# EAGLE schematic board_with_sense (EAGLE 6.1)

## Sheet 1 of 2
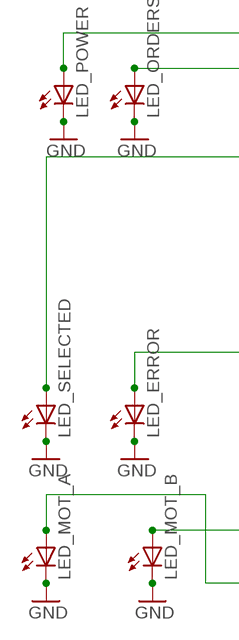
[diagram p0: schematic, sheet 1, part 1 of 2]
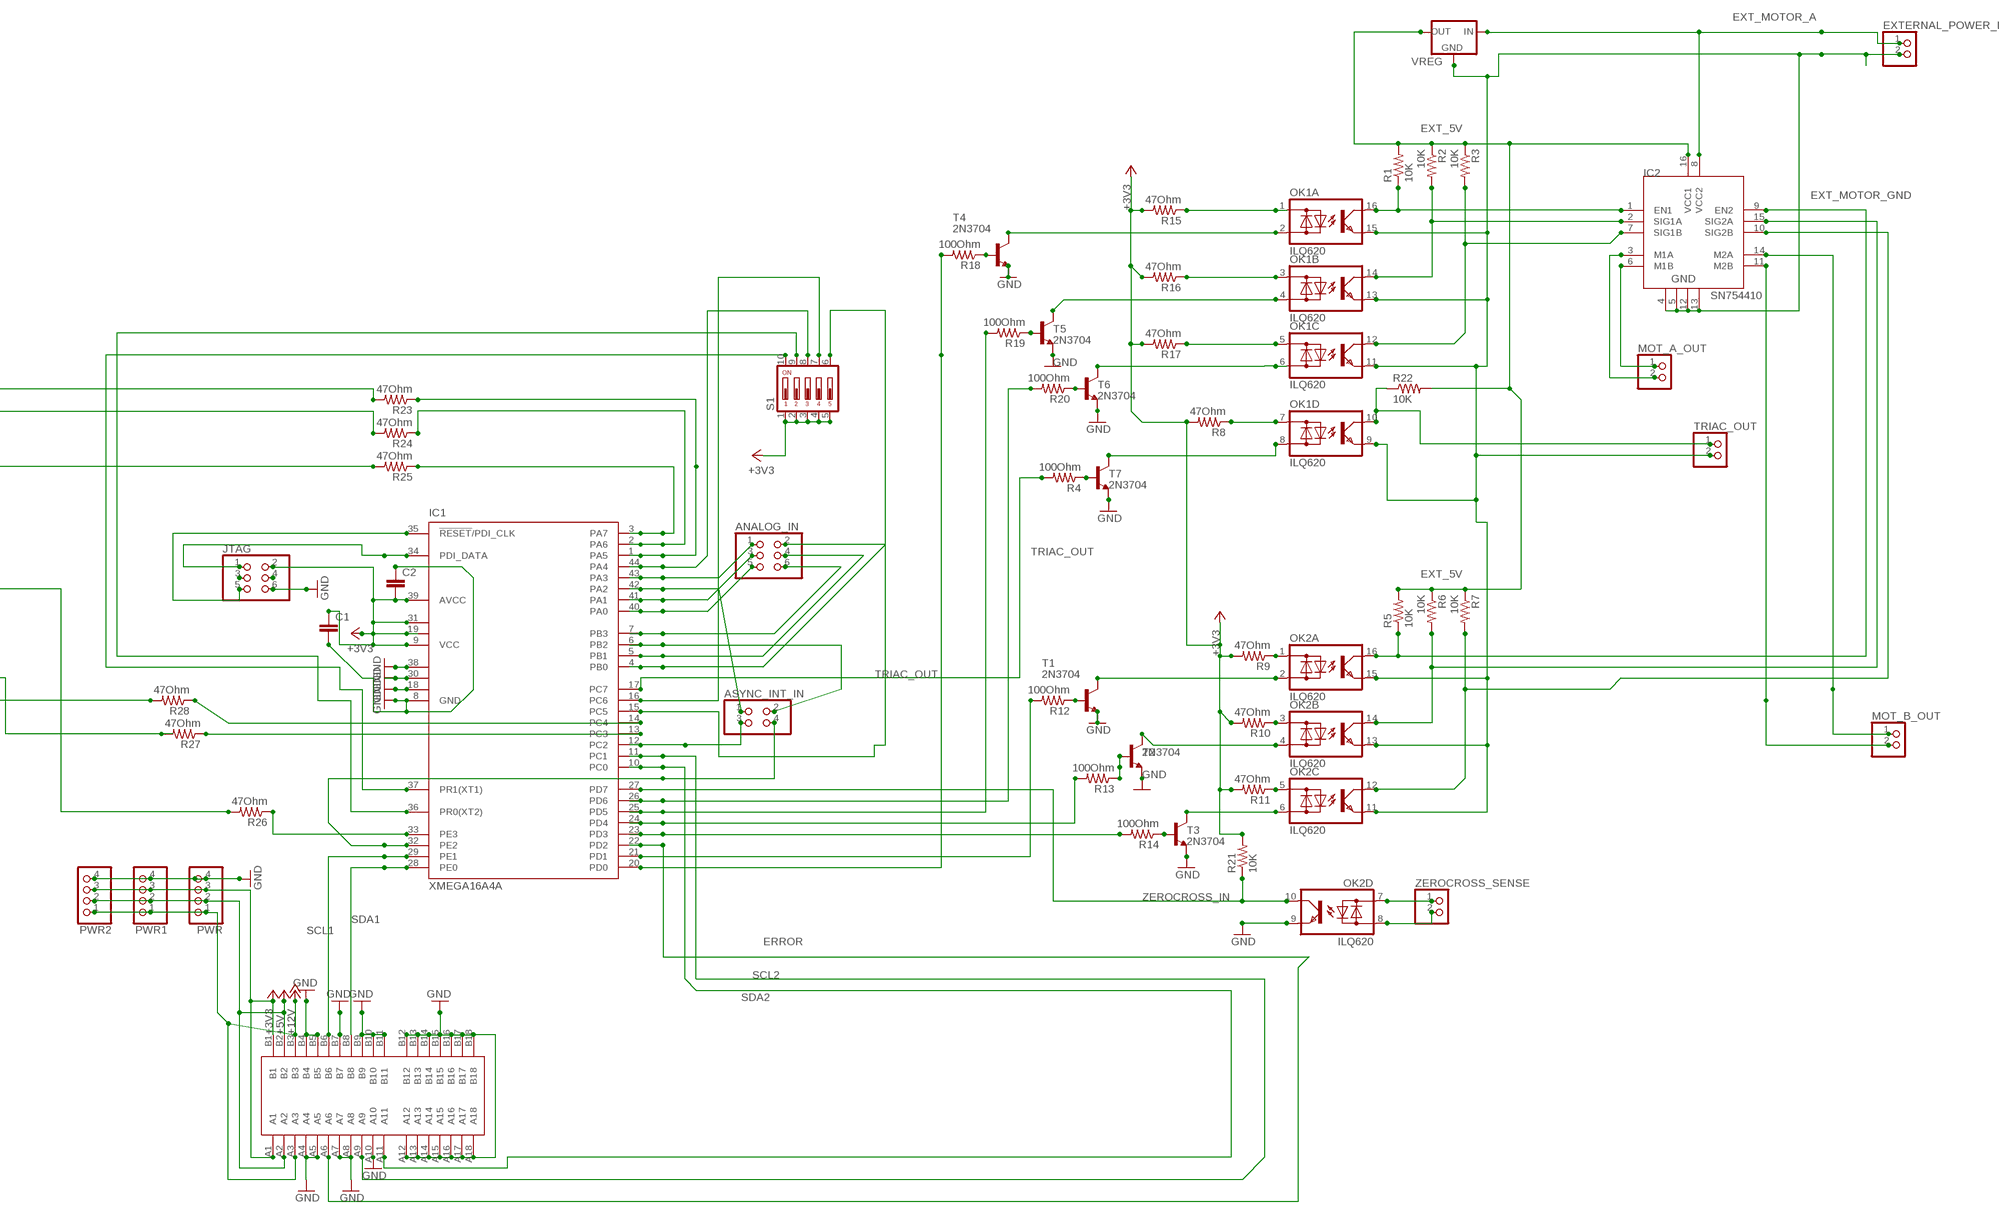
[diagram p1: schematic, sheet 1, part 2 of 2]

### Parts
ANALOG_IN  PINHD-2X3  [2X03]
ASYNC_INT_IN  PINHD-2X2  [2X02]
C1  C2.5/4  [C2.5-4]
C2  C2.5/4  [C2.5-4]
EXTERNAL_POWER_IN  PINHD-1X2  [1X02]
IC1  XMEGA16A4A  [TQFP44]
IC2  SN754410  [DIP16]
JTAG  PINHD-2X3  [2X03]
LED_ERROR  LED5MM  [LED5MM]
LED_MOT_A  LED5MM  [LED5MM]
LED_MOT_B  LED5MM  [LED5MM]
LED_ORDERS  LED5MM  [LED5MM]
LED_POWER  LED5MM  [LED5MM]
LED_SELECTED  LED5MM  [LED5MM]
MOT_A_OUT  PINHD-1X2  [1X02]
MOT_B_OUT  PINHD-1X2  [1X02]
OK1  ILQ620  [DIL16]
OK2  ILQ620  [DIL16]
PWR  PINHD-1X4  [1X04]
PWR1  PINHD-1X4  [1X04]
PWR2  PINHD-1X4  [1X04]
R1  10K  R-US_R0805  [R0805]
R2  10K  R-US_R0805  [R0805]
R3  10K  R-US_R0805  [R0805]
R4  100Ohm  R-US_0207/10  [0207/10]
R5  10K  R-US_R0805  [R0805]
R6  10K  R-US_R0805  [R0805]
R7  10K  R-US_R0805  [R0805]
R8  47Ohm  R-US_0207/10  [0207/10]
R9  47Ohm  R-US_0207/10  [0207/10]
R10  47Ohm  R-US_0207/10  [0207/10]
R11  47Ohm  R-US_0207/10  [0207/10]
R12  100Ohm  R-US_0207/10  [0207/10]
R13  100Ohm  R-US_R0805  [R0805]
R14  100Ohm  R-US_R0805  [R0805]
R15  47Ohm  R-US_0207/10  [0207/10]
R16  47Ohm  R-US_0207/10  [0207/10]
R17  47Ohm  R-US_0207/10  [0207/10]
R18  100Ohm  R-US_R0805  [R0805]
R19  100Ohm  R-US_R0805  [R0805]
R20  100Ohm  R-US_R0805  [R0805]
R21  10K  R-US_0207/10  [0207/10]
R22  10K  R-US_R0805  [R0805]
R23  47Ohm  R-US_0204/7  [0204/7]
R24  47Ohm  R-US_0204/7  [0204/7]
R25  47Ohm  R-US_0204/7  [0204/7]
R26  47Ohm  R-US_0204/7  [0204/7]
R27  47Ohm  R-US_0204/7  [0204/7]
R28  47Ohm  R-US_0204/7  [0204/7]
S1  DA05  [DA-05]
T1  2N3704  [TO92]
T2  2N3704  [TO92]
T3  2N3704  [TO92]
T4  2N3704  [TO92]
T5  2N3704  [TO92]
T6  2N3704  [TO92]
T7  2N3704  [TO92]
TRIAC_OUT  PINHD-1X2  [1X02]
VREG  78MXXL  [78MXXL]
X1  PCI-E1X_EDGE  [PCI-E_X1_EDGE]
ZEROCROSS_SENSE  PINHD-1X2  [1X02]

### Nets
+3V3: C1.1 C2.2 IC1.9(VCC) IC1.19(VCC1) IC1.31(VCC2) IC1.39(AVCC) JTAG.2 PWR1.3 PWR2.3 PWR.3 R8.2 R9.2 R10.2 R11.2 R15.2 R16.2 R17.2 R21.2 S1.1 S1.2 S1.3 S1.4 S1.5 X1.A1 X1.B1
+5V: PWR1.2 PWR2.2 PWR.2 X1.A2 X1.B2
+12V: PWR1.1 PWR2.1 PWR.1 X1.A3 X1.B3
ERROR: IC1.22(PD2) X1.A6
EXT_5V: IC2.16(VCC1) R1.2 R2.1 R3.1 R5.2 R6.1 R7.1 R22.2 VREG.OUT
EXT_MOTOR_A [POWER]: EXTERNAL_POWER_IN.1 IC2.8(VCC2) VREG.IN
EXT_MOTOR_GND [clearance]: EXTERNAL_POWER_IN.2 IC2.4 IC2.5 IC2.12 IC2.13 OK1.9(D:E) OK1.11(C:E) OK1.13(B:E) OK1.15(A:E) OK2.11(C:E) OK2.13(B:E) OK2.15(A:E) TRIAC_OUT.2 VREG.GND
GND [clearance]: C1.2 C2.1 IC1.8(GND) IC1.18(GND1) IC1.30(GND2) IC1.38(GND3) JTAG.6 LED_ERROR.K(C) LED_MOT_A.K(C) LED_MOT_B.K(C) LED_ORDERS.K(C) LED_POWER.K(C) LED_SELECTED.K(C) OK2.9(D:E) PWR1.4 PWR2.4 PWR.4 T1.3(E) T2.3(E) T3.3(E) T4.3(E) T5.3(E) T6.3(E) T7.3(E) X1.A4 X1.A5 X1.A7 X1.A8 X1.A10 X1.A12 X1.A13 X1.A14 X1.A15 X1.A16 X1.A17 X1.A18 X1.B4 X1.B5 X1.B7 X1.B9 X1.B10 X1.B11 X1.B12 X1.B13 X1.B14 X1.B15 X1.B16 X1.B17 X1.B18
N$1: IC1.3(PA7) R25.1
N$2: IC1.35(!RESET!/PDI_CLK) JTAG.5
N$3: R4.1 T7.1(B)
N$4: LED_POWER.A R23.2
N$5: OK1.10(D:C) R22.1 TRIAC_OUT.1
N$6: LED_ORDERS.A R24.2
N$7: LED_SELECTED.A R25.2
N$8: OK1.7(D:AC1) R8.1
N$9: IC1.34(PDI_DATA) JTAG.1
N$10: IC1.33(PE3) R26.1
N$11: LED_ERROR.A R26.2
N$12: ANALOG_IN.4 IC1.5(PB1)
N$13: ANALOG_IN.6 IC1.7(PB3)
N$14: ASYNC_INT_IN.3 IC1.12(PC2)
N$15: IC1.13(PC3) R27.1
N$16: ANALOG_IN.1 IC1.43(PA3)
N$17: IC1.14(PC4) R28.1
N$18: ASYNC_INT_IN.4 IC1.32(PE2)
N$19: LED_MOT_B.A R28.2
N$20: IC1.2(PA6) R24.1
N$21: ASYNC_INT_IN.2 IC1.6(PB2)
N$22: LED_MOT_A.A R27.2
N$23: IC1.36(PR0(XT2)) S1.9
N$24: IC1.37(PR1(XT1)) S1.10
N$25 [clearance]: OK1.8(D:AC2) T7.2(C)
N$26: JTAG.3
N$27: JTAG.4
N$28: OK2.7(D:AC1) ZEROCROSS_SENSE.1
N$29 [clearance]: OK2.2(A:AC2) T1.2(C)
N$30: OK2.1(A:AC1) R9.1
N$31 [POWER]: IC2.3(M1A) MOT_A_OUT.2
N$32 [POWER]: IC2.6(M1B) MOT_A_OUT.1
N$33: IC2.1(EN1) OK1.16(A:C) R1.1
N$34: IC2.2(SIG1A) OK1.14(B:C) R2.2
N$35: IC2.7(SIG1B) OK1.12(C:C) R3.2
N$36: OK2.8(D:AC2) ZEROCROSS_SENSE.2
N$37: IC1.20(PD0) R18.2
N$39 [POWER]: IC2.11(M2B) MOT_B_OUT.2
N$40: IC2.9(EN2) OK2.16(A:C) R5.1
N$41: IC2.15(SIG2A) OK2.14(B:C) R6.2
N$42: IC2.10(SIG2B) OK2.12(C:C) R7.2
N$43 [POWER]: IC2.14(M2A) MOT_B_OUT.1
N$45: IC1.16(PC6) S1.7
N$46: IC1.15(PC5) S1.6
N$47: OK2.3(B:AC1) R10.1
N$48: OK2.5(C:AC1) R11.1
N$49: OK2.4(B:AC2) T2.2(C)
N$50: OK2.6(C:AC2) T3.2(C)
N$51 [clearance]: R12.1 T1.1(B)
N$52: R13.1 T2.1(B)
N$53: R14.1 T3.1(B)
N$55: IC1.23(PD3) R14.2
N$56: IC1.24(PD4) R13.2
N$57: OK1.2(A:AC2) T4.2(C)
N$58: OK1.4(B:AC2) T5.2(C)
N$59: OK1.6(C:AC2) T6.2(C)
N$60: R18.1 T4.1(B)
N$61: R19.1 T5.1(B)
N$62: R20.1 T6.1(B)
N$65: IC1.25(PD5) R19.2
N$66: IC1.26(PD6) R20.2
N$67: OK1.1(A:AC1) R15.1
N$68: OK1.3(B:AC1) R16.1
N$69: OK1.5(C:AC1) R17.1
N$70: IC1.44(PA4) S1.8
N$71: ANALOG_IN.2 IC1.4(PB0)
N$73: ANALOG_IN.5 IC1.40(PA0)
N$74: ANALOG_IN.3 IC1.41(PA1)
N$75: ASYNC_INT_IN.1 IC1.42(PA2)
N$77: IC1.1(PA5) R23.1
PWM_A: IC1.21(PD1) R12.2
SCL1: IC1.29(PE1) X1.B6
SCL2: IC1.11(PC1) X1.A9
SDA1: IC1.28(PE0) X1.B8
SDA2: IC1.10(PC0) X1.A11
TRIAC_OUT: IC1.17(PC7) R4.2
ZEROCROSS_IN: IC1.27(PD7) OK2.10(D:C) R21.1

## Sheet 2 of 2

## Library data of the parts
ANALOG_IN JTAG = pinhead:PINHD-2X3: PIN HEADER
ASYNC_INT_IN = pinhead:PINHD-2X2: PIN HEADER
C1 C2 = capacitor-wima:C: CAPACITOR naming: grid - package width
EXTERNAL_POWER_IN MOT_A_OUT MOT_B_OUT TRIAC_OUT ZEROCROSS_SENSE = pinhead:PINHD-1X2: PIN HEADER
IC1 = atmel:XMEGA16A4: MICROCONTROLLER Features High-performance, Low-power 8/16-bit AVR XMEGA Microcontroller Non-Volatile Program and Data Memories - 16 KB - 128 KB of In-System Self-Programmable Flash - 4 KB - 8 KB Boot Code Section with Independent Lock Bits - 1 KB - 2 KB EEPROM - 2 KB - 8 KB Internal SRAM Peripheral Features - Four-channel DMA Controller with support for external requests - Eight-channel Event System - Five 16-bit Timer/Counters Three Timer/Counters with 4 Output Compare or Input Capture channels Two Timer/Counters with 2 Output Compare or Input Capture channels High-Resolution Extensions on all Timer/Counters Advanced Waveform Extension on one Timer/Counter - Five USARTs IrDA Extension on one USART - Two Two-Wire Interfaces with dual address match (I2C and SMBus compatible) - Two SPIs (Serial Peripheral Interfaces) peripherals - AES and DES Crypto Engine - 16-bit Real Time Counter with Separate Oscillator - One Twelve-channel, 12-bit, 2 Msps Analog to Digital Converter - One Two-channel, 12-bit, 1 Msps Digital to Analog Converter - Two Analog Comparators with Window compare function - External Interrupts on all General Purpose I/O pins - Programmable Watchdog Timer with Separate On-chip Ultra Low Power Oscillator Special Microcontroller Features - Power-on Reset and Programmable Brown-out Detection - Internal and External Clock Options with PLL - Programmable Multi-level Interrupt Controller - Sleep Modes: Idle, Power-down, Standby, Power-save, Extended Standby - Advanced Programming, Test and Debugging Interfaces PDI (Program and Debug Interface) for programming, test and debugging I/O and Packages - 34 Programmable I/O Lines - 44 - lead TQFP - 44 - pad VQFN/QFN - 49 - ball VFBGA Operating Voltage - 1.6 - 3.6V Speed performance - 0 - 12 MHz @ 1.6 - 3.6V - 0 - 32 MHz @ 2.7 - 3.6V Drawn by Dipl.-Ing. (FH) Robert Siegler Created: 27.05.09; OC_FARNELL: unknown; OC_NEWARK: unknown
IC2 = HBridge:SN754410: Quadruple half-H driver
LED_ERROR LED_MOT_A LED_MOT_B LED_ORDERS LED_POWER LED_SELECTED = led:LED: LED OSRAM: - CHIPLED LG R971, LG N971, LY N971, LG Q971, LY Q971, LO R971, LY R971 LH N974, LH R974 LS Q976, LO Q976, LY Q976 LO Q996 - Hyper CHIPLED LW Q18S LB Q993, LB Q99A, LB R99A - SideLED LS A670, LO A670, LY A670, LG A670, LP A670 LB A673, LV A673, LT A673, LW A673 LH A674 LY A675 LS A676, LA A676, LO A676, LY A676, LW A676 LS A679, LY A679, LG A679 - Hyper Micro SIDELED® LS Y876, LA Y876, LO Y876, LY Y876 LT Y87S - SmartLED LW L88C, LW L88S LB L89C, LB L89S, LG L890 LS L89K, LO L89K, LY L89K LS L896, LA L896, LO L896, LY L896 - TOPLED LS T670, LO T670, LY T670, LG T670, LP T670 LSG T670, LSP T670, LSY T670, LOP T670, LYG T670 LG T671, LOG T671, LSG T671 LB T673, LV T673, LT T673, LW T673 LH T674 LS T676, LA T676, LO T676, LY T676, LB T676, LH T676, LSB T676, LW T676 LB T67C, LV T67C, LT T67C, LS T67K, LO T67K, LY T67K, LW E67C LS E67B, LA E67B, LO E67B, LY E67B, LB E67C, LV E67C, LT E67C LW T67C LS T679, LY T679, LG T679 LS T770, LO T770, LY T770, LG T770, LP T770 LB T773, LV T773, LT T773, LW T773 LH T774 LS E675, LA E675, LY E675, LS T675 LS T776, LA T776, LO T776, LY T776, LB T776 LHGB T686 LT T68C, LB T68C - Hyper Mini TOPLED® LB M676 - Mini TOPLED Santana® LG M470 LS M47K, LO M47K, LY M47K Source: http://www.osram.convergy.de LUXEON: - LUMILED® LXK2-PW12-R00, LXK2-PW12-S00, LXK2-PW14-U00, LXK2-PW14-V00 LXK2-PM12-R00, LXK2-PM12-S00, LXK2-PM14-U00 LXK2-PE12-Q00, LXK2-PE12-R00, LXK2-PE12-S00, LXK2-PE14-T00, LXK2-PE14-U00 LXK2-PB12-K00, LXK2-PB12-L00, LXK2-PB12-M00, LXK2-PB14-N00, LXK2-PB14-P00, LXK2-PB14-Q00 LXK2-PR12-L00, LXK2-PR12-M00, LXK2-PR14-Q00, LXK2-PR14-R00 LXK2-PD12-Q00, LXK2-PD12-R00, LXK2-PD12-S00 LXK2-PH12-R00, LXK2-PH12-S00 LXK2-PL12-P00, LXK2-PL12-Q00, LXK2-PL12-R00 Source: www.luxeon.com KINGBRIGHT: KA-3528ASYC Source: www.kingbright.com
OK1 OK2 = optocoupler:ILQ620: SIEMENS OPTO COUPLER
PWR PWR1 PWR2 = pinhead:PINHD-1X4: PIN HEADER
R1-R28 = resistor:R-US_: RESISTOR, American symbol
S1 = switch-dil:DA05: DIL/CODE SWITCH
T1-T7 = transistor:2N3704: NPN TRANSISTOR
VREG = v-reg:78MXXL: VOLTAGE REGULATOR
X1 = con-pci_express(pci-e):PCI-E1X_EDGE

## Net classes
0 default: width 0.203 mm, clearance 0.305 mm
1 POWER: width 0.813 mm, clearance 0.203 mm
2 clearance: width 0.203 mm, clearance 0.61 mm